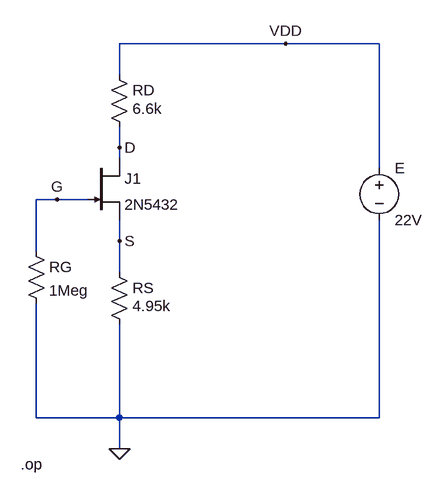
[diagram p0: schematic Polarizare TECJ.asc]
Polarizare TECJ.asc, the LTspice schematic file:
Version 4.1
SHEET 1 880 680
WIRE 480 -64 224 -64
WIRE 624 -64 480 -64
WIRE 224 -16 224 -64
WIRE 224 96 224 64
WIRE 224 112 224 96
WIRE 624 128 624 -64
WIRE 128 176 96 176
WIRE 176 176 128 176
WIRE 224 240 224 208
WIRE 96 256 96 176
WIRE 224 288 224 240
WIRE 96 512 96 336
WIRE 224 512 224 368
WIRE 224 512 96 512
WIRE 624 512 624 208
WIRE 624 512 224 512
WIRE 224 560 224 512
FLAG 224 560 0
FLAG 128 176 G
FLAG 224 96 D
FLAG 224 240 S
FLAG 480 -64 VDD
SYMBOL njf 176 112 R0
SYMATTR InstName J1
SYMATTR Value 2N5432
SYMBOL res 80 240 R0
SYMATTR InstName RG
SYMATTR Value 1Meg
SYMBOL res 208 272 R0
WINDOW 3 36 68 Left 2
SYMATTR Value 4.95k
SYMATTR InstName RS
SYMBOL voltage 624 112 R0
SYMATTR InstName E
SYMATTR Value 22V
SYMBOL res 208 -32 R0
WINDOW 3 36 68 Left 2
SYMATTR Value 6.6k
SYMATTR InstName RD
TEXT 72 584 Left 2 !.op

The netlist it stands for:
* Polarizare TECJ.asc
J1 D G S 2N5432
RG G 0 1Meg
RS S 0 4.95k
V§E VDD 0 22V
RD VDD D 6.6k
.model NJF NJF
.model PJF PJF
.lib standard.jft
.op
.backanno
.end

* Results of the author's LTspice run, read from the files saved beside the schematic
* Operating Point:
*   V(d) = 15.17 V
*   V(g) = 66.12 µV
*   V(s) = 5.121 V
*   V(vdd) = 22 V
*   I(E) = -1.035 mA
*   I(RD) = 1.035 mA
*   I(RG) = 66.12 pA
*   I(RS) = 1.035 mA
*   Id(J1) = 1.035 mA
*   Ig(J1) = -66.12 pA
*   Is(J1) = -1.035 mA